# EAGLE design Oscillator Core Sch (EAGLE 7.7.0)
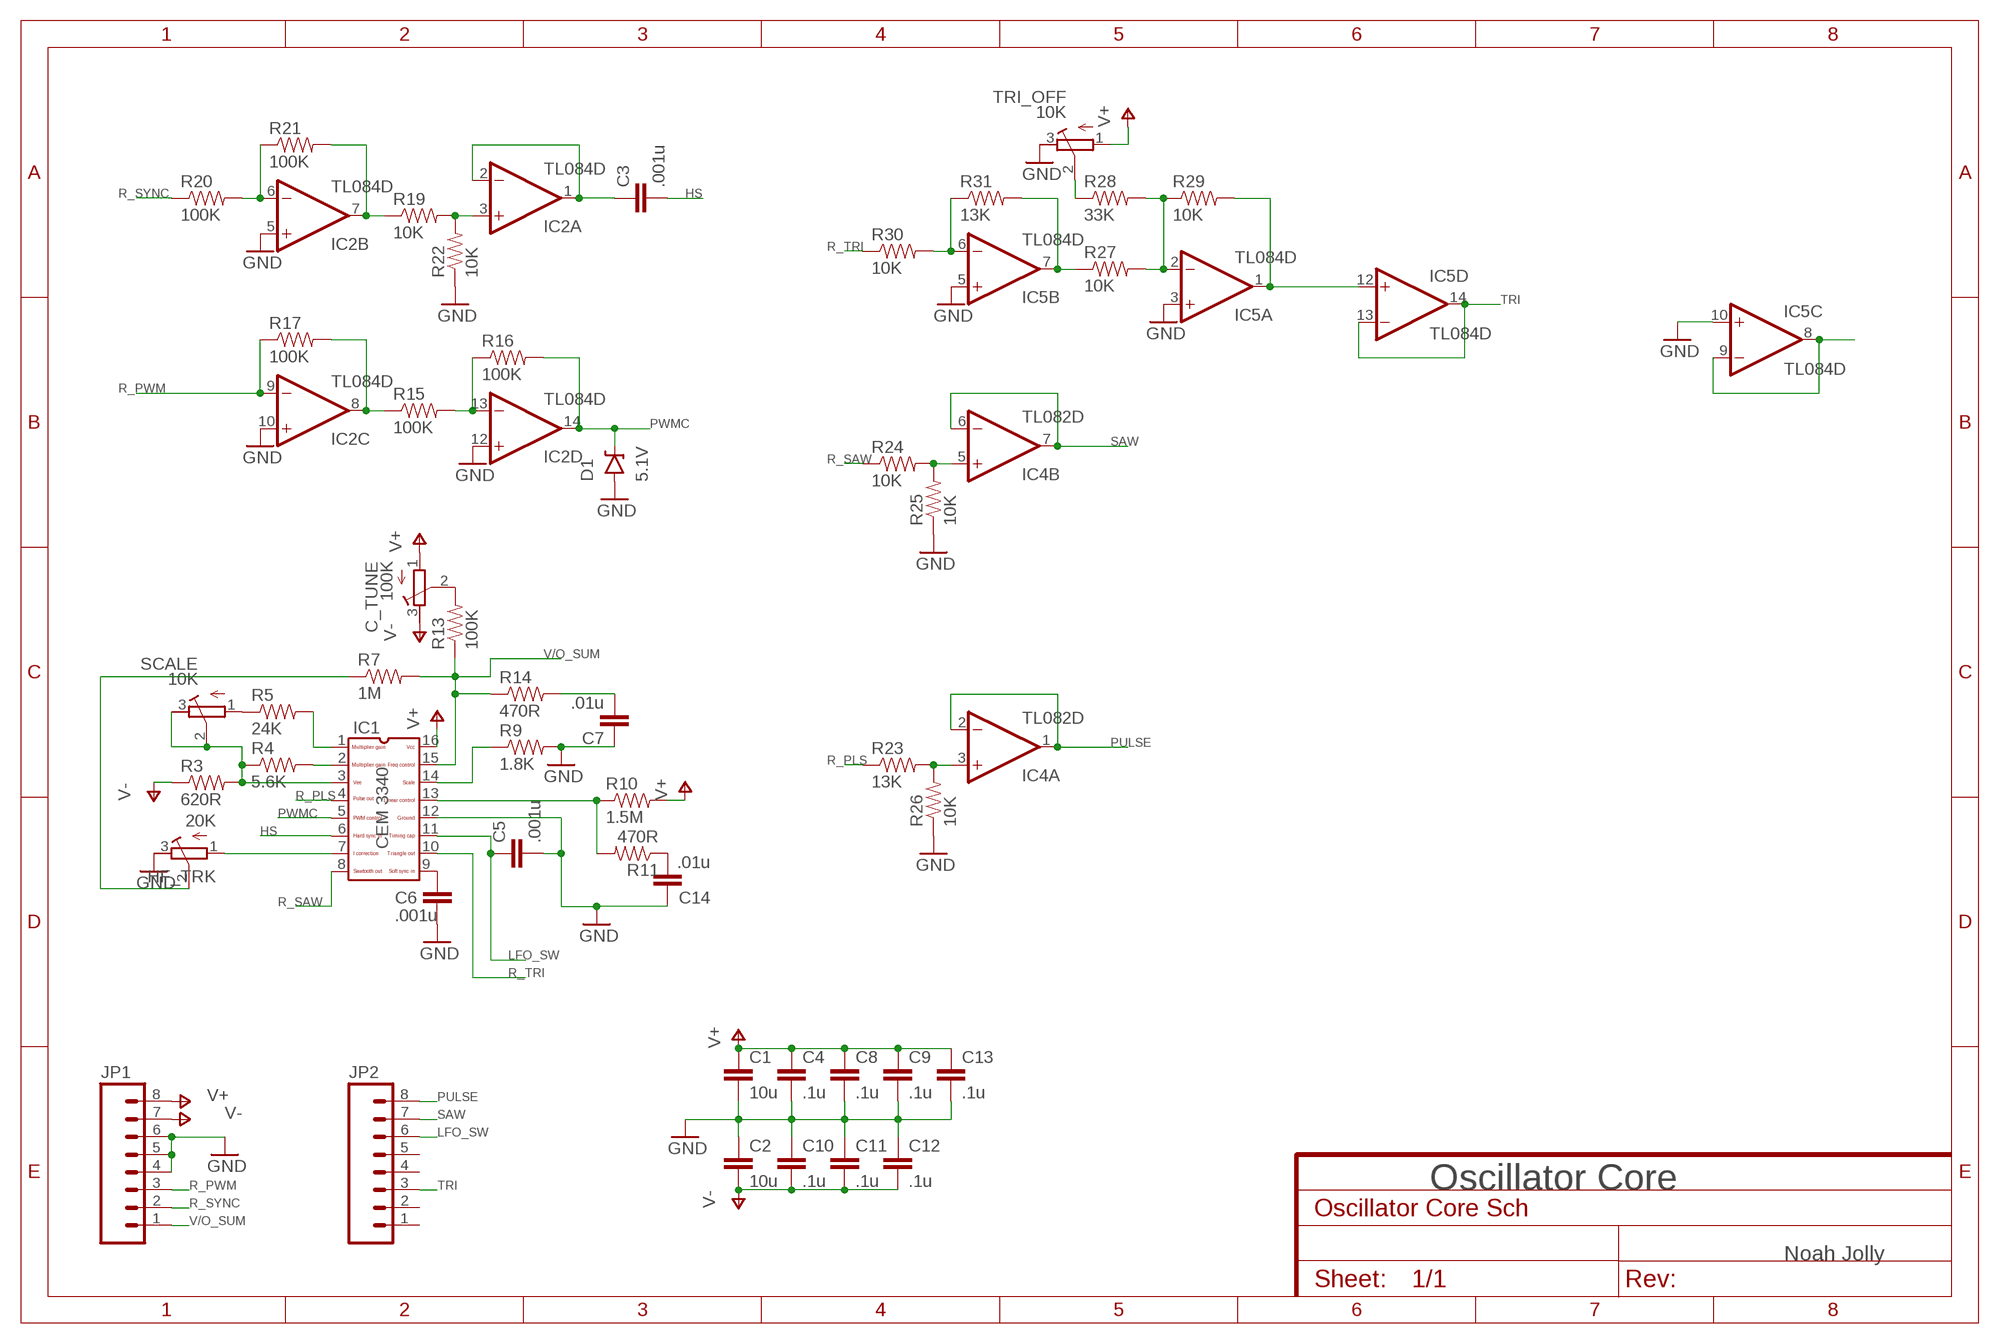
[diagram p0: schematic, sheet 1]

## Parts
C1  10u  CAP1206  [1206]
C2  10u  CAP1206  [1206]
C3  .001u  CAP0805  [0805]
C4  .1u  CAP0805  [0805]
C5  .001u  CAPPTH1  [CAP-PTH-5MM]
C6  .001u  CAP0805  [0805]
C7  .01u  CAP0805  [0805]
C8  .1u  CAP0805  [0805]
C9  .1u  CAP0805  [0805]
C10  .1u  CAP0805  [0805]
C11  .1u  CAP0805  [0805]
C12  .1u  CAP0805  [0805]
C13  .1u  CAP0805  [0805]
C14  .01u  CAP0805  [0805]
C_TUNE  100K  R-TRIMM3296Y  [RTRIM3296Y]
D1  5.1V  DIODE-ZENER16V  [SOD-123]
HF_TRK  20K  R-TRIMM3296Y  [RTRIM3296Y]
IC1  CEM3340  [DIL16]
IC2  TL084D  [SO14]
IC4  TL082D  [SO08]
IC5  TL084D  [SO14]
JP1  M08  [1X08_ROUND]
JP2  M08  [1X08_ROUND]
R3  620R  RESISTOR0805-RES  [0805@1]
R4  5.6K  RESISTOR0805-RES  [0805@1]
R5  24K  RESISTOR0805-RES  [0805@1]
R7  1M  RESISTOR0805-RES  [0805@1]
R9  1.8K  RESISTOR0805-RES  [0805@1]
R10  1.5M  RESISTOR0805-RES  [0805@1]
R11  470R  RESISTOR0805-RES  [0805@1]
R13  100K  RESISTOR0805-RES  [0805@1]
R14  470R  RESISTOR0805-RES  [0805@1]
R15  100K  RESISTOR0805-RES  [0805@1]
R16  100K  RESISTOR0805-RES  [0805@1]
R17  100K  RESISTOR0805-RES  [0805@1]
R19  10K  RESISTOR0805-RES  [0805@1]
R20  100K  RESISTOR0805-RES  [0805@1]
R21  100K  RESISTOR0805-RES  [0805@1]
R22  10K  RESISTOR0805-RES  [0805@1]
R23  13K  RESISTOR0805-RES  [0805@1]
R24  10K  RESISTOR0805-RES  [0805@1]
R25  10K  RESISTOR0805-RES  [0805@1]
R26  10K  RESISTOR0805-RES  [0805@1]
R27  10K  RESISTOR0805-RES  [0805@1]
R28  33K  RESISTOR0805-RES  [0805@1]
R29  10K  RESISTOR0805-RES  [0805@1]
R30  10K  RESISTOR0805-RES  [0805@1]
R31  13K  RESISTOR0805-RES  [0805@1]
SCALE  10K  R-TRIMM3296Y  [RTRIM3296Y]
TRI_OFF  10K  R-TRIMM3296Y  [RTRIM3296Y]

## Nets
GND: C1.2 C2.1 C4.2 C5.2 C6.2 C7.1 C8.2 C9.2 C10.1 C11.1 C12.1 C13.2 C14.1 D1.A HF_TRK.3(E) IC1.12 IC2.5(B:+IN) IC2.10(C:+IN) IC2.12(D:+IN) IC5.3(A:+IN) IC5.5(B:+IN) IC5.10(C:+IN) JP1.4 JP1.5 JP1.6 R9.2 R22.1 R25.1 R26.1 TRI_OFF.3(E)
HS: C3.2 IC1.6
LFO_SW: C5.1 IC1.11 JP2.6
N$1: R5.1 SCALE.1(A)
N$2: IC1.3 R3.2 R4.1 SCALE.2(S) SCALE.3(E)
N$3: IC1.2 R4.2
N$4: IC1.1 R5.2
N$5: HF_TRK.2(S) R7.1
N$6: HF_TRK.1(A) IC1.7
N$8: C_TUNE.2(S) R13.2
N$9: IC1.14 R9.1
N$10: IC1.13 R10.1 R11.2
N$11: IC2.8(C:OUT) R15.1 R17.2
N$12: C6.1 IC1.9
N$13: IC2.13(D:-IN) R15.2 R16.1
N$14: C7.2 R14.2
N$15: IC4.5(B:+IN) R24.2 R25.2
N$16: IC5.8(C:OUT) IC5.9(C:-IN)
N$18: C14.2 R11.1
N$24: IC2.3(A:+IN) R19.2 R22.2
N$25: IC2.6(B:-IN) R20.2 R21.1
N$26: IC2.7(B:OUT) R19.1 R21.2
N$27: C3.1 IC2.1(A:OUT) IC2.2(A:-IN)
N$28: IC4.3(A:+IN) R23.2 R26.2
N$34: IC5.6(B:-IN) R30.2 R31.1
N$35: IC5.7(B:OUT) R27.1 R31.2
N$37: IC5.2(A:-IN) R27.2 R28.2 R29.1
N$38: IC5.1(A:OUT) IC5.12(D:+IN) R29.2
N$39: R28.1 TRI_OFF.2(S)
PULSE: IC4.1(A:OUT) IC4.2(A:-IN) JP2.8
PWMC: D1.C IC1.5 IC2.14(D:OUT) R16.2
R_PLS: IC1.4 R23.1
R_PWM: IC2.9(C:-IN) JP1.3 R17.1
R_SAW: IC1.8 R24.1
R_SYNC: JP1.2 R20.1
R_TRI: IC1.10 R30.1
SAW: IC4.6(B:-IN) IC4.7(B:OUT) JP2.7
TRI: IC5.13(D:-IN) IC5.14(D:OUT) JP2.3
V+: C1.1 C4.1 C8.1 C9.1 C13.1 C_TUNE.1(A) IC1.16 JP1.8 R10.2 TRI_OFF.1(A)
V-: C2.2 C10.2 C11.2 C12.2 C_TUNE.3(E) JP1.7 R3.1
V/O_SUM: IC1.15 JP1.1 R7.2 R13.1 R14.1
Unconnected: JP2.1 JP2.2 JP2.4 JP2.5

## Notes on the sheet
- Oscillator Core
- Noah Jolly

## Power pins joined to a net without a drawn wire
V+: IC2.4(P:V+) IC4.8(P:V+) IC5.4(P:V+)
V-: IC2.11(P:V-) IC4.4(P:V-) IC5.11(P:V-)

## Library data of the parts
C1-C4 C6-C14 = SparkFun-Capacitors:CAP: Capacitor Standard 0603 ceramic capacitor, and 0.1" leaded capacitor.
C5 = SparkFun-Passives:CAP: Capacitor Standard 0603 ceramic capacitor, and 0.1" leaded capacitor.
C_TUNE HF_TRK SCALE TRI_OFF = rcl:R-TRIMM: Trimm resistor
D1 = SparkFun-DiscreteSemi:DIODE-ZENER: Zener Diode Production Part - 8199 3.4V Zener Voltage; PROD_ID: DIO-12440; VALUE: 16V
IC1 = CEM:CEM3340: CEM 3340 VCO
IC2 IC5 = linear:TL084: OP AMP
IC4 = linear:TL082: OP AMP Data sheet <http://www.ti.com/lit/ds/symlink/tl084a . pdf>; DATA_SHEET: <a href="http://www.ti.com/lit/ds/symlink/tl084a.pdf"> Data sheet </a>
JP1 JP2 = SparkFun-Connectors:M08: Header 8 Standard 8-pin 0.1" header. Use with straight break away headers (SKU : PRT-00116), right angle break away headers (PRT-00553), swiss pins (PRT-00743), machine pins (PRT-00117), and female headers (PRT-00115).
R3-R5 R7 R9-R11 R13-R17 R19-R31 = SparkFun-Passives:RESISTOR: Resistor Basic schematic elements and footprints for 0603, 1206, and PTH resistors.

## Board
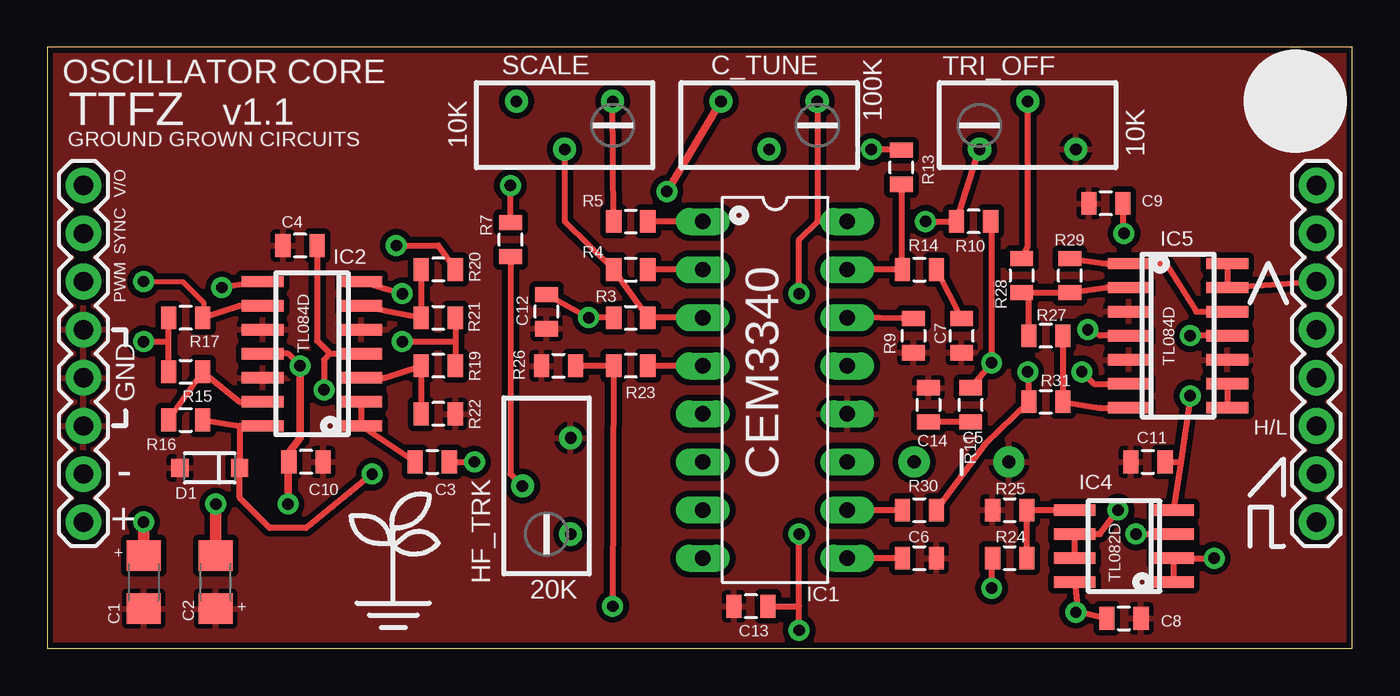
[diagram p1: board, top side]
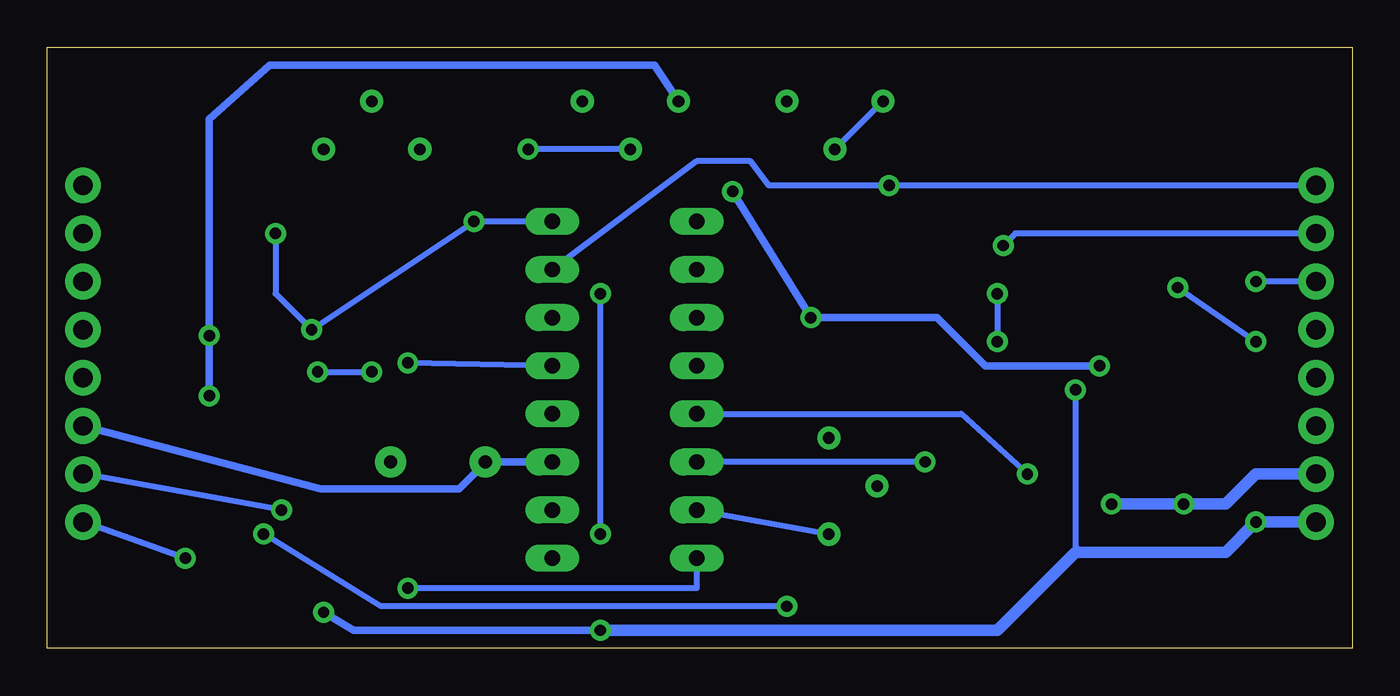
[diagram p2: board, bottom side, seen from below]

Size 68.88 x 31.74 mm. Coordinates in mm from the lower left corner, seen from the top.
Outline: 0,0 68.88,0 68.88,31.74 0,31.74 0,0
Copper layers (1*16): Top 0.035mm / dielectric 1.5mm / Bottom 0.035mm
Design rules "SparkFun": minimum track width 8mil, minimum drill 20mil, track to track 8mil, track to pad 8mil, pad to pad 8mil, via to via 8mil, smd to smd 8mil, copper to edge 8mil, drill to drill 8mil, minimum pad ring 12mil, minimum via ring 10mil, stop-mask expansion 4mil, vias tented up to drill 20mil, thermal gap 10mil

### Footprints (pad centres in the part's own frame; a part is rotated, then mirrored left to right if it is on the bottom)
1206 = smd 1.6 x 1.8: 1 -1.4,0; 2 1.4,0
0805 = smd 0.8 x 1.2: 1 -0.9,0; 2 0.9,0
CAP-PTH-5MM = drill 0.7 pad 1.651: 1 -2.5,0; 2 2.5,0
RTRIM3296Y = drill 0.61: 1 1.27,-2.54; 2 -1.27,0; 3 1.27,2.54
SOD-123 = smd 0.9 x 0.95: A 1.575,0; C -1.575,0
DIL16 = drill 0.813 long: 1 -8.89,-3.81; 2 -6.35,-3.81; 3 -3.81,-3.81; 4 -1.27,-3.81; 5 1.27,-3.81; 6 3.81,-3.81; 7 6.35,-3.81; 8 8.89,-3.81; 9 8.89,3.81; 10 6.35,3.81; 11 3.81,3.81; 12 1.27,3.81; 13 -1.27,3.81; 14 -3.81,3.81; 15 -6.35,3.81; 16 -8.89,3.81
SO14 = smd 0.6 x 2.2: 1 -3.81,-2.6; 2 -2.54,-2.6; 3 -1.27,-2.6; 4 0,-2.6; 5 1.27,-2.6; 6 2.54,-2.6; 7 3.81,-2.6; 8 3.81,2.6; 9 2.54,2.6; 10 1.27,2.6; 11 0,2.6; 12 -1.27,2.6; 13 -2.54,2.6; 14 -3.81,2.6
SO08 = smd 0.6 x 2.2: 1 -1.905,-2.6; 2 -0.635,-2.6; 3 0.635,-2.6; 4 1.905,-2.6; 5 1.905,2.6; 6 0.635,2.6; 7 -0.635,2.6; 8 -1.905,2.6
1X08_ROUND = drill 1.016 pad 1.88: 1 0,0; 2 2.54,0; 3 5.08,0; 4 7.62,0; 5 10.16,0; 6 12.7,0; 7 15.24,0; 8 17.78,0
0805@1 = smd 0.8 x 1.2: 1 -0.9,0; 2 0.9,0

### Placement (x,y rotation side)
C1  5.08,3.49 270 top
C2  8.89,3.49 90 top
C3  20.32,9.84 0 top
C4  13.34,21.27 180 top
C5  48.26,9.84 0 top
C6  46.04,4.76 0 top
C7  48.26,16.51 90 top
C8  56.83,1.59 0 top
C9  55.88,23.5 180 top
C10  13.65,9.84 180 top
C11  58.1,9.84 0 top
C12  26.35,17.78 90 top
C13  37.15,2.22 180 top
C14  46.51,12.86 270 top
C_TUNE  38.1,27.62 90 top
D1  8.57,9.53 180 top
HF_TRK  26.35,8.57 0 top
IC1  38.42,13.65 270 top
IC2  13.97,15.56 90 top
IC4  56.83,5.4 90 top
IC5  59.69,16.51 270 top
JP1  1.91,24.45 270 top
JP2  66.99,24.45 270 top
R3  30.8,17.46 0 top
R4  30.8,20 0 top
R5  30.8,22.54 0 top
R7  24.45,21.59 90 top
R9  45.72,16.51 270 top
R10  48.9,22.54 180 top
R11  48.74,12.86 90 top
R13  45.09,25.4 90 top
R14  46.04,20 0 top
R15  7.3,14.61 0 top
R16  7.3,12.06 0 top
R17  7.3,17.46 180 top
R19  20.64,14.92 180 top
R20  20.64,20 180 top
R21  20.64,17.46 0 top
R22  20.64,12.38 180 top
R23  30.8,14.92 180 top
R24  50.8,4.76 0 top
R25  50.8,7.3 0 top
R26  26.99,14.92 0 top
R27  52.7,16.51 180 top
R28  51.44,19.68 270 top
R29  53.98,19.68 90 top
R30  46.04,7.3 0 top
R31  52.7,13.02 0 top
SCALE  27.3,27.62 90 top
TRI_OFF  51.75,27.62 270 top

### Tracks (layer width: path | path; a pad name or v marks a point on that pad's centre or on a via)
GND
  pour Top (isolate 0.305): 0,0 0,31.43 0,31.75 68.9,31.75 68.9,0
HS  (via drill 0.6)
  Top 0.305: C3.2 v22.54,9.84
  Bottom 0.305: v22.54,9.84 IC1.6
LFO_SW
  Bottom 0.406: IC1.11 C5.1 45.76,9.8 47.15,8.41 54.45,8.41 JP2.6
N$1
  Top 0.305: R5.1 SCALE.1
N$2
  Top 0.305: IC1.3 R3.2 R4.1 27.3,22.54 SCALE.2
  Bottom 0.305: SCALE.2 SCALE.3
N$3
  Top 0.305: IC1.2 R4.2
N$4
  Top 0.305: IC1.1 R5.2
N$5
  Top 0.305: R7.1 24.45,9.21 HF_TRK.2
N$6
  Bottom 0.305: IC1.7 HF_TRK.1
N$8  (via drill 0.6)
  Top 0.305: v43.5,26.35 45.35,26.35 R13.2
  Bottom 0.305: C_TUNE.2 v43.5,26.35
N$9
  Top 0.305: R9.1 IC1.14
N$10  (via drill 0.6)
  Top 0.305: R11.2 v49.85,15.08 49.85,22.49 R10.1
  Bottom 0.305: IC1.13 v49.85,15.08
N$11  (via drill 0.6)
  Top 0.305: R15.1 6.4,16.19 | 6.4,16.19 R17.2 | IC2.8 v9.21,19.05 | v5.08,16.19 6.4,16.19
  Bottom 0.305: v9.21,19.05 v5.08,16.19
N$12
  Top 0.305: C6.1 IC1.9
N$13
  Top 0.305: R16.1 R15.2 10.16,13.02 IC2.13
N$14
  Top 0.305: R14.2 C7.2
N$15
  Top 0.305: R24.2 R25.2 IC4.5
N$16
  Top 0.305: IC5.9 IC5.8
N$18
  Top 0.305: R11.1 48.79,11.96 C14.2
N$24
  Top 0.305: IC2.3 17.78,14.29 R19.2 R22.2
N$25
  Top 0.305: IC2.6 18.1,17.78 R21.1 R20.2
N$26  (via drill 0.6)
  Top 0.305: IC2.7 v18.73,18.73 | R21.2 21.54,16.19 | 21.54,16.19 R19.1 | v18.73,16.19 21.54,16.19
  Bottom 0.305: v18.73,18.73 v18.73,16.19
N$27
  Top 0.305: IC2.2 IC2.1 C3.1
N$28  (via drill 0.6)
  Top 0.305: R26.2 R23.2 v29.84,2.22 | v57.47,6.03 IC4.3
  Bottom 0.305: v29.84,2.22 51.28,2.22 v57.47,6.03
N$34  (via drill 0.6)
  Top 0.305: v51.75,14.61 R31.1 49.53,10.79 R30.2 | v54.61,14.61 55.24,13.97 IC5.6
  Bottom 0.305: v54.61,14.61 v51.75,14.61
N$35
  Top 0.305: IC5.7 55.56,12.7 R31.2 R27.1
N$37
  Top 0.305: IC5.2 55.88,19.05 R29.1 R28.2 51.8,18.41 R27.2
N$38
  Top 0.305: R29.2 55.88,20.32 IC5.1 59.05,20.32 60.64,17.78 IC5.12
N$39
  Top 0.305: R28.1 51.75,21.27 TRI_OFF.2
PULSE  (via drill 0.6)
  Top 0.305: IC4.1 IC4.2 v61.59,4.76
  Bottom 0.305: v61.59,4.76 JP2.8
PWMC  (via drill 0.6)
  Top 0.305: R16.2 10.16,11.75 | 10.16,11.75 IC2.14 | v17.14,9.21 13.65,6.35 11.75,6.35 10.16,7.94 10.16,9.51 D1.C 10.16,11.75
  Bottom 0.305: IC1.5 20.64,12.38 v17.14,9.21
R_PLS
  Top 0.305: IC1.4 R23.1
R_PWM  (via drill 0.6)
  Top 0.254: v5.08,19.37 7.14,19.37 8.26,18.26 8.26,17.52 R17.1
  Top 0.305: R17.1 10.16,18.1 IC2.9
  Bottom 0.305: JP1.3 v5.08,19.37
R_SAW  (via drill 0.6)
  Top 0.305: v49.85,3.17 49.85,4.71 R24.1
  Bottom 0.305: IC1.8 34.61,3.17 v49.85,3.17
R_SYNC  (via drill 0.6)
  Top 0.305: v18.41,21.27 20.64,21.27 R20.1
  Bottom 0.305: JP1.2 17.78,21.91 v18.41,21.27
R_TRI
  Top 0.305: IC1.10 R30.1
SAW  (via drill 0.6)
  Top 0.305: IC4.7 IC4.6 55.56,6.03 v56.52,7.3
  Bottom 0.305: v56.52,7.3 JP2.7
TRI
  Top 0.305: IC5.14 IC5.13 JP2.3
V+  (via drill 0.6)
  Top 0.305: C4.1 14.23,16.25 14.92,15.56 | 14.92,15.56 IC2.4 | 14.92,15.56 14.61,15.24 v14.61,13.65 | IC1.16 40.64,22.54 | 40.64,22.54 39.69,21.59 v39.69,18.73 | v46.35,22.54 R10.2 TRI_OFF.1 | C_TUNE.1 40.64,22.54 | v39.69,0.95 39.69,2.22 | 39.69,2.22 v39.69,6.03 | IC4.8 54.4,1.96 | 54.4,1.96 C8.1 | v54.29,1.91 54.34,1.91 54.4,1.96 | IC5.4 55.56,16.51 v54.93,16.83 | C9.1 56.78,21.96 v56.83,21.91 | C13.1 39.69,2.22
  Top 0.61: v5.08,6.67 C1.1
  Bottom 0.305: v14.61,13.65 14.61,5.4 14.29,5.08 | IC1.16 v46.35,22.54 v54.93,16.83 56.83,18.73 v56.83,21.91 | v39.69,6.03 v39.69,18.73
  Bottom 0.406: v54.29,1.91 52.7,0.95 v39.69,0.95
  Bottom 0.61: JP1.8 v5.08,6.67 6.67,5.08 14.29,5.08 14.61,5.08 18.73,0.95 v39.69,0.95
V-  (via drill 0.6)
  Top 0.305: 12.65,10.21 C10.2 12.7,9.79 | v13.34,14.92 12.7,15.56 IC2.11 | R3.1 v28.57,17.46 C12.2 | v60.33,13.34 59.82,9.84 | 59.82,9.84 IC4.4 | IC5.11 v60.33,16.51 | C11.2 59.82,9.84
  Top 0.406: 12.65,10.21 13.34,11.11 v13.34,14.92 | v12.7,7.62 12.7,9.79 | C_TUNE.3 v32.7,24.13
  Top 0.61: v8.89,7.62 C2.2
  Bottom 0.305: v60.33,16.51 60.33,16.19
  Bottom 0.406: v13.34,14.92 19.37,14.92 21.91,17.46 v28.57,17.46 v32.7,24.13 | C_TUNE.3 36.83,30.8 57.15,30.8 60.33,27.94 60.33,16.19 v60.33,13.34
  Bottom 0.61: JP1.7 5.08,9.21 6.67,7.62 v8.89,7.62 v12.7,7.62
V/O_SUM  (via drill 0.6)
  Top 0.305: R7.2 v24.45,24.45 | R13.1 45.09,20.05 R14.1 IC1.15
  Bottom 0.305: JP1.1 v24.45,24.45 30.8,24.45 31.75,25.72 34.61,25.72 IC1.15

### Text on the board
tPlace: OSCILLATOR CORE | v1.1 | TTFZ | GROUND GROWN CIRCUITS | V/O | SYNC | PWM | GND | H/L | - | + | + | +